# Altium schematic sheet ECR_Schem_1.SchDoc: ECR ESP32
size A3; Organization: INNEXIV Private Limited; Address2: Islamabad; Address3: Pakistan; DocumentNumber: 1.0; Revision: 1.0; SheetNumber: 1; SheetTotal: 1
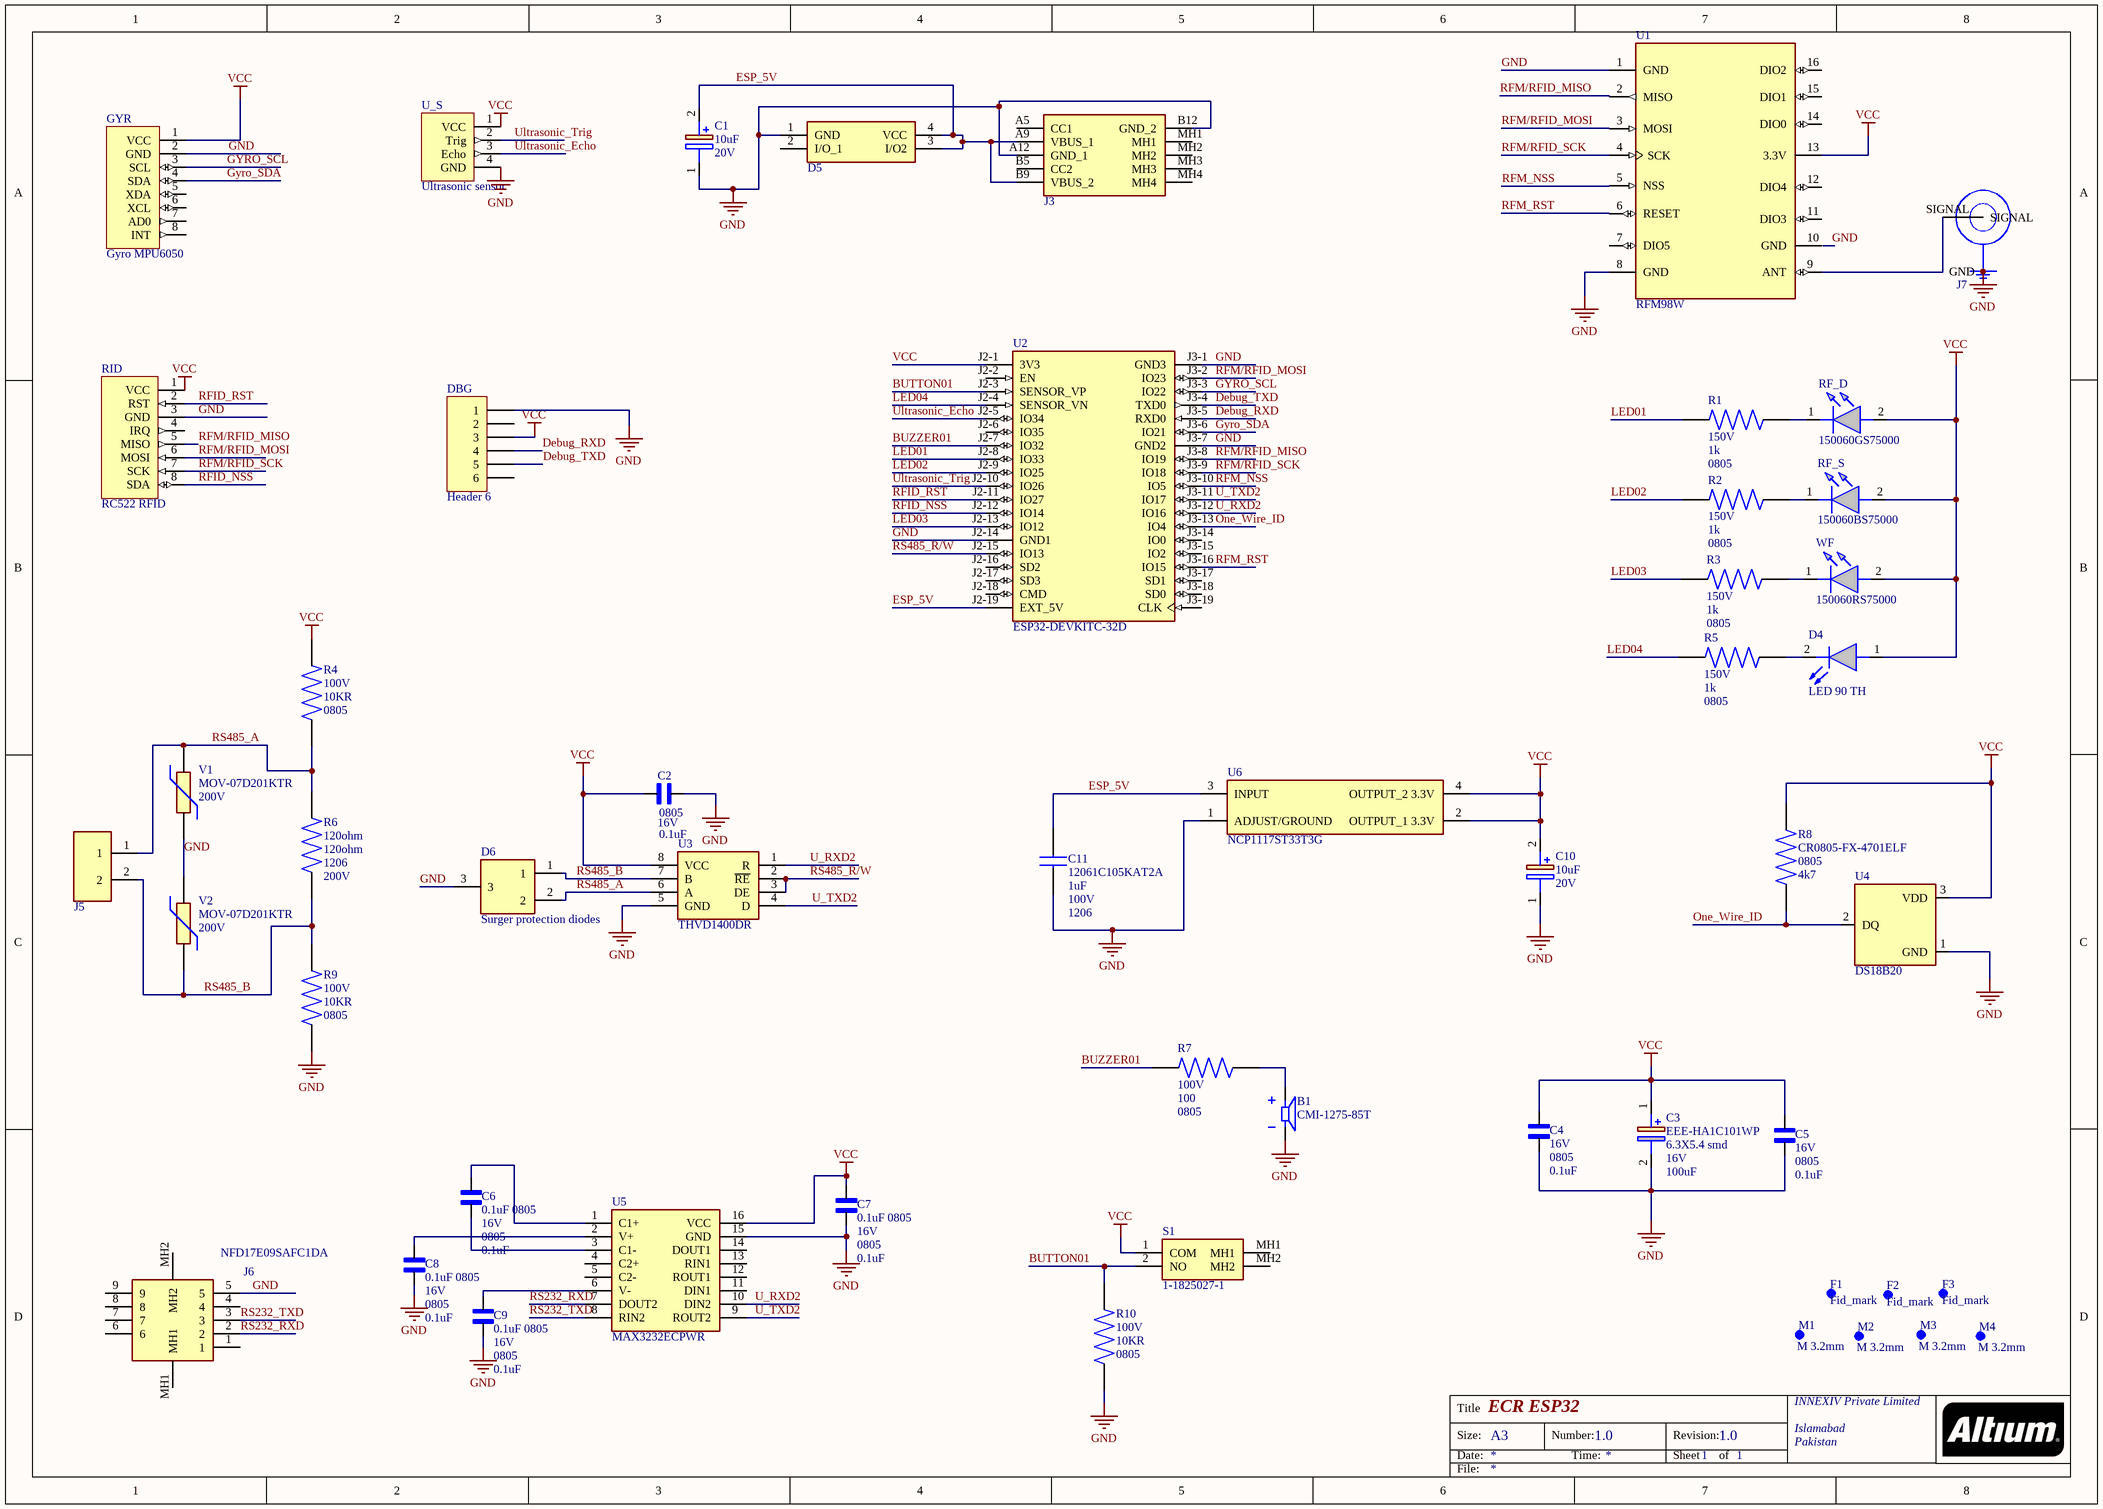
[diagram p0: ECR_Schem_1.SchDoc]

## Parts
B1  CMI-1275-85T  [CUI_CMI-1275-85T]
C1  value 10uF  Voltage: 20V  [CAPPM3528X210N]  (hidden comment: 10uF SMD Tantalum)
C2  value 0.1uF  Voltage: 16V  Package: 0805  [CAPC2012X90N]  (hidden comment: 0.1uF 0805)
C3  EEE-HA1C101WP  value 100uF  Package: 6.3X5.4 smd  Voltage: 16V  [CAPAE660X800N]
C4  value 0.1uF  Voltage: 16V  Package: 0805  [CAPC2012X90N]  (hidden comment: 0.1uF 0805)
C5  value 0.1uF  Voltage: 16V  Package: 0805  [CAPC2012X90N]  (hidden comment: 0.1uF 0805)
C6  0.1uF 0805  value 0.1uF  Voltage: 16V  Package: 0805  [CAPC2012X90N]
C7  0.1uF 0805  value 0.1uF  Voltage: 16V  Package: 0805  [CAPC2012X90N]
C8  0.1uF 0805  value 0.1uF  Voltage: 16V  Package: 0805  [CAPC2012X90N]
C9  0.1uF 0805  value 0.1uF  Voltage: 16V  Package: 0805  [CAPC2012X90N]
C10  value 10uF  Voltage: 20V  [CAPPM3528X210N]  (hidden comment: 10uF SMD Tantalum)
C11  12061C105KAT2A  value 1uF  Voltage: 100V  Package: 1206  [CAPC3216X229N]
D4  LED 90 TH  [HV-31210/260/SUB-U1930]
D5  5V fuse USB line  [SR0502CTG]  (value not drawn)
D6  Surger protection diodes  [SOT95P230X117-3N]
DBG  Header 6  [HDR1X6]
F1  Fid_mark  [FUP]  (no BOM)
F2  Fid_mark  [FUP]  (no BOM)
F3  Fid_mark  [FUP]  (no BOM)
GYR  Gyro MPU6050  [MPU_8pin]
J3  USB Type C PCB  [USB4125GFA]  (value not drawn)
J5  3.81mm wire to pcb  [1728284 3.81 wire to pcb]  (value not drawn)
J6  NFD17E09SAFC1DA  [NFD17E09SAFC1DA]
J7  IPEX antenna connector PCB  [AMPHENOL_A-1JB]  (value not drawn)
M1  M 3.2mm  [Screw Hole 3.2mm]  (no BOM)
M2  M 3.2mm  [Screw Hole 3.2mm]  (no BOM)
M3  M 3.2mm  [Screw Hole 3.2mm]  (no BOM)
M4  M 3.2mm  [Screw Hole 3.2mm]  (no BOM)
R1  value 1k  Voltage: 150V  Package: 0805  [0805_RESC2012X50N]  (hidden comment: 1kohm 0805)
R2  value 1k  Voltage: 150V  Package: 0805  [0805_RESC2012X50N]  (hidden comment: 1kohm 0805)
R3  value 1k  Voltage: 150V  Package: 0805  [0805_RESC2012X50N]  (hidden comment: 1kohm 0805)
R4  value 10KR  Voltage: 100V  Package: 0805  [0805_RESC2012X50N]  (hidden comment: 10K 0805)
R5  value 1k  Voltage: 150V  Package: 0805  [0805_RESC2012X50N]  (hidden comment: 1kohm 0805)
R6  120ohm  Package: 1206  Voltage: 200V  [1206_RESC3216X06N]
R7  value 100  Voltage: 100V  Package: 0805  [0805_RESC2012X50N]  (hidden comment: 100ohm 0805)
R8  CR0805-FX-4701ELF  value 4k7  Package: 0805  [0805_RESC2012X50N]
R9  value 10KR  Voltage: 100V  Package: 0805  [0805_RESC2012X50N]  (hidden comment: 10K 0805)
R10  value 10KR  Voltage: 100V  Package: 0805  [0805_RESC2012X50N]  (hidden comment: 10K 0805)
RF_D  150060GS75000  [LEDC1608X80N]
RF_S  150060BS75000  [LEDC1608X80N]
RID  RC522 RFID  [RFID_8pin]
S1  1-1825027-1  [118250271]
U1  RFM98W  [XCVR_RFM98W-433S2]
U2  ESP32-DEVKITC-32D  [MODULE_ESP32-DEVKITC-32D]
U3  THVD1400DR  [SOIC127P600X175-8N]
U4  DS18B20  [TO-92-TO92127P495H2044-3]
U5  MAX3232ECPWR  [SOP65P640X120-16N]
U6  NCP1117ST33T3G  [SOT230P700X180-4N]
U_S  Ultrasonic sensor  [UltraSonic 4 Pins]
V1  MOV-07D201KTR  Voltage: 200V  [MOV07D201KTR]
V2  MOV-07D201KTR  Voltage: 200V  [MOV07D201KTR]
WF  150060RS75000  [LEDC1608X80N]

## Nets
GND: B1.N C1.1 C2.2 C3.2(-) C4.1 C5.1 C7.1 C8.1 C9.1 C10.1 C11.1 D5.1(GND) D6.3 DBG.1 GYR.2(GND) J3.A12(GND_1) J3.B12(GND_2) J6.5 J7.GND1(GND) J7.GND2(GND) J7.OPTIONAL_GND(GND) R9.1 R10.1 RID.3(GND) U1.1(GND) U1.8(GND) U2.J2-14(GND1) U2.J3-1(GND3) U2.J3-7(GND2) U3.5(GND) U4.1(GND) U5.15(GND) U6.1(ADJUST/GROUND) U_S.4(GND) V1.1 V2.2
VCC: C2.1 C3.1(+) C4.2 C5.2 C7.2 C10.2 D4.1(A) DBG.3 GYR.1(VCC) R4.2 R8.2 RF_D.2(A) RF_S.2(A) RID.1(VCC) S1.1(COM) U1.13(3.3V) U2.J2-1(3V3) U3.8(VCC) U4.3(VDD) U5.16(VCC) U6.2(OUTPUT_1_3.3V) U6.4(OUTPUT_2_3.3V) U_S.1(VCC) WF.2(A)
BUTTON01: R10.2 S1.2(NO) U2.J2-3(SENSOR_VP)
BUZZER01: R7.1 U2.J2-7(IO32)
Debug_RXD: DBG.4 U2.J3-5(RXD0)
Debug_TXD: DBG.5 U2.J3-4(TXD0)
ESP_5V: C1.2 C11.2 D5.3(I/O2) D5.4(VCC) J3.A9(VBUS_1) J3.B9(VBUS_2) U2.J2-19(EXT_5V) U6.3(INPUT)
GYRO_SCL: GYR.3(SCL) U2.J3-3(IO22)
Gyro_SDA: GYR.4(SDA) U2.J3-6(IO21)
LED01: R1.1 U2.J2-8(IO33)
LED02: R2.1 U2.J2-9(IO25)
LED03: R3.1 U2.J2-13(IO12)
LED04: R5.1 U2.J2-4(SENSOR_VN)
One_Wire_ID: R8.1 U2.J3-13(IO4) U4.2(DQ)
RFID_NSS: RID.8(SDA) U2.J2-12(IO14)
RFID_RST: RID.2(RST) U2.J2-11(IO27)
RFM/RFID_MISO: RID.5(MISO) U1.2(MISO) U2.J3-8(IO19)
RFM/RFID_MOSI: RID.6(MOSI) U1.3(MOSI) U2.J3-2(IO23)
RFM/RFID_SCK: RID.7(SCK) U1.4(SCK) U2.J3-9(IO18)
RFM_NSS: U1.5(NSS) U2.J3-10(IO5)
RFM_RST: U1.6(RESET) U2.J3-16(IO15)
RS232_RXD: J6.2 U5.7(DOUT2)
RS232_TXD: J6.3 U5.8(RIN2)
RS485_A: D6.2 J5.1 R4.1 R6.2 U3.6(A) V1.2
RS485_B: D6.1 J5.2 R6.1 R9.2 U3.7(B) V2.1
RS485_R/W: U2.J2-15(IO13) U3.2(~{RE}) U3.3(DE)
U_RXD2: U2.J3-12(IO16) U3.1(R) U5.10(DIN2)
U_TXD2: U2.J3-11(IO17) U3.4(D) U5.9(ROUT2)
Ultrasonic_Echo: U2.J2-5(IO34) U_S.3(Echo)
Ultrasonic_Trig: U2.J2-10(IO26) U_S.2(Trig)
NetB1_P: B1.P R7.2
NetC6_1: C6.1 U5.3(C1-)
NetC6_2: C6.2 U5.1(C1+)
NetC8_2: C8.2 U5.2(V+)
NetC9_2: C9.2 U5.6(V-)
NetD4_2: D4.2(K) R5.2
NetJ7_SIGNAL: J7.SIGNAL U1.9(ANT)
NetR1_2: R1.2 RF_D.1(K)
NetR2_2: R2.2 RF_S.1(K)
NetR3_2: R3.2 WF.1(K)

Not connected (* = marked no-connect by the designer): D5 2(I/O_1); DBG 2 6; GYR 5(XDA) 6(XCL) 7(AD0) 8(INT); J3 A5(CC1) B5(CC2) MH1 MH2 MH3 MH4; J6 1 4 6 7 8 9 MH1 MH2; RID 4(IRQ); S1 MH1 MH2; U1 7(DIO5) 10(GND) 11(DIO3) 12(DIO4) 14(DIO0) 15(DIO1) 16(DIO2); U2 J2-2(EN) J2-6(IO35) J2-16(SD2) J2-17(SD3) J2-18(CMD) J3-14(IO0) J3-15(IO2) J3-17(SD1) J3-18(SD0) J3-19(CLK); U5 4(C2+) 5(C2-) 11(DIN1) 12(ROUT1) 13(RIN1) 14(DOUT1)

## Notes on the sheet
- Title
- Size:
- Date:
- A3
- Number:
- Time:
- Revision:
- Sheet
- of
- File:

## Library data of the parts
B1 = CMI-1275-85T: 5V CUI Inc Buzzer; Price: None; Availability: Unavailable; MP: CMI-1275-85T; Package: None; Value: *
C1 C10 = TPSB106K020R1000: TPS SMT tant capacitor,Case B,20V,10uF AVX 10uF SMD Solid MnO2 Tantalum Electrolytic Capacitor, 20 V dc /-10%, TPS Series; Manufacturer_Name: Kyocera AVX; Datasheet Link: http://datasheets.avx.com/TPS.pdf; Height: 2.1mm; Manufacturer_Part_Number: TPSB106K020R1000; Mouser Part Number: 581-TPSB106K020R1000; Mouser Price/Stock: https://www.mouser.co.uk/ProductDetail/AVX/TPSB106K020R1000?qs=SRux0XfyV6nBXE%252BNULTPuA%3D%3D; Arrow Part Number: TPSB106K020R1000; Arrow Price/Stock: https://www.arrow.com/en/products/tpsb106k020r1000/avx
C2 C4-C9 = VJ0805Y104JXJPW1BC: Cap Ceramic 0.1uF 16V X7R 5% SMD 0805 125Â°C Paper T/R; MF: Vishay Vitramon; SnapEDA_Link: https://www.snapeda.com/parts/VJ0805Y104JXJPW1BC/Vishay+Vitramon/view-part/?ref=snap; MP: VJ0805Y104JXJPW1BC; Check_prices: https://www.snapeda.com/parts/VJ0805Y104JXJPW1BC/Vishay+Vitramon/view-part/?ref=eda
C3 = EEE-HA1C101WP: Cap Aluminum Lytic 100uF 16V 20% (6.3 X 5.4mm) SMD 70mA 1000h 105C Automotive T/R
C11 = 12061C105KAT2A: Capacitor MLCC 1206 1uF 100V AVX 1206 FlEXITERM 1??F Ceramic Multilayer Capacitor, 100 V dc X7R Dielectric ??10% SMD; Geometry.Height: 2.29mm; Manufacturer_Name: AVX; Manufacturer_Part_Number: 12061C105KAT2A; Mouser Part Number: 581-12061C105KAT2A; Mouser Price/Stock: https://www.mouser.co.uk/ProductDetail/AVX/12061C105KAT2A?qs=sEn5VCT5PiZZ0oBgoI7byA%3D%3D; Arrow Part Number: 12061C105KAT2A; Arrow Price/Stock: https://www.arrow.com/en/products/12061c105kat2a/avx; Datasheet Link: http://datasheets.avx.com/X7RDielectric.pdf
D4 = HV-31210/260/SUB-U1930: HARVATEK 3.0MM ROUND LED LAMP WI; Color: Blue; Package: TH 90degree
D5 = SR05-02CTG: LITTELFUSE - SR05-02CTG - DIODE, ESD PROTECTION, 5V, SOT-143; Datasheet Link: https://www.arrow.com/en/products/sr05-02ctg/littelfuse; Height: 1mm; Manufacturer_Name: LITTELFUSE; Manufacturer_Part_Number: SR05-02CTG; Mouser Part Number: 576-SR05-02CTG; Mouser Price/Stock: https://www.mouser.co.uk/ProductDetail/Littelfuse/SR05-02CTG?qs=txCqAXsCGkfW1ErBg03wlg%3D%3D; Arrow Part Number: SR05-02CTG; Arrow Price/Stock: https://www.arrow.com/en/products/sr05-02ctg/littelfuse?region=nac
D6 = CDSOT23-SM712: Diode; Manufacturer_Name: Bourns; Datasheet Link: http://uk.rs-online.com/web/p/products/7673728; Height: 1.17mm; Manufacturer_Part_Number: CDSOT23-SM712; Mouser Part Number: 652-CDSOT23-SM712; Mouser Price/Stock: https://www.mouser.co.uk/ProductDetail/Bourns/CDSOT23-SM712?qs=FuI%252BOVLl4%2FLTY%2FGQ265RLA%3D%3D; Arrow Part Number: CDSOT23-SM712; Arrow Price/Stock: https://www.arrow.com/en/products/cdsot23-sm712/bourns?region=europe
DBG = Header 6: Header, 6-Pin; LatestRevisionDate: 17-Jul-2002; LatestRevisionNote: Re-released for DXP Platform.; Publisher: Altium Limited
F1-F3 = Fid_mark: Fiducial_mark
GYR = MPU_6050: MPU_6050 / Gyroscope
J3 = USB4125-GF-A: USB-C (USB TYPE-C) Receptacle Connector 24 (6+18 Dummy) Position Surface Mount, Right Angle; Through Hole; Manufacturer_Name: GCT (GLOBAL CONNECTOR TECHNOLOGY); Datasheet Link: https://gct.co/files/drawings/usb4125.pdf?v=f2858e04-a173-4b74-b17f-8f865ddc3728; Height: 3.41mm; Manufacturer_Part_Number: USB4125-GF-A; Mouser Part Number: 640-USB4125-GF-A; Mouser Price/Stock: https://www.mouser.co.uk/ProductDetail/GCT/USB4125-GF-A?qs=KUoIvG%2F9IlaIQ4zBJ6gLeA%3D%3D
J5 = 1728284 terminal block 3.81: TERM BLOCK 2POS 55DEG 3.81MM PCB; Manufacturer: Phoenix contact; Price: 1
J6 = NFD17E09SAFC1DA: D-Sub, 9 Pin Socket, Right Angle, Boardlocks #4-40 UNC Threaded Hole; Manufacturer_Name: Amphenol Communications Solutions; Geometry.Height: 12.93mm; Manufacturer_Part_Number: NFD17E09SAFC1DA; Mouser Part Number: *; Mouser Price/Stock: *; Arrow Part Number: *; Arrow Price/Stock: *; Datasheet Link: https://cdn.amphenol-cs.com/media/wysiwyg/files/drawing/p-nfd17-xxxsa-fc1d-a.pdf
J7 = A-1JB: AMC IPEX Straight PCB Jack, Surface Mount, 2500 pc Reel, 50 Ohm; Package: None; MP: A-1JB; Price: None; Availability: Unavailable; Value: *
M1-M4 = Munting Hole 3.2mm: PCB Munting Hole 3.2mm; Package: Mounting Screw
R1-R3 R5 = AC0805JR-071KL: Thick Film Resistors - SMD 1 k Ohms 125mW 0805 5% AEC-Q200 Standard Power Version; MF: {'manufacturer': u'Bourns'}; Availability: Unavailable; MP: AC0805JR-071KL; Tolerance: 5%
R4 R9 R10 = CR0805-FX-1002ELF: RESISITOR, 0805, 10KR, 1%; Power Rating:125mW; Resistance:10kohm; Resistance Tolerance:Â± 1%; Series:CR; Operating Temperature Range:-55Â°C to +155Â°C; Resistor Element Type:Thick Film; Voltage, Rating:100V; Temperature Coefficient:Â± 100ppm; Case Style:0805; MF: {'manufacturer': u'Bourns'}; MP: CR0805-FX-1002ELF; Availability: Unavailable
R6 = WR12X1002FTL: RES 120 OHM 5% 1/4W 1206; Part Number: WR12X1002FTL; Value: 120ohm
R7 = ERJ-P06J101V: Thick Film Resistors - SMD 0805 100ohms 0.5W 5% Tolerance; MF: {'manufacturer': u'Bourns'}; Availability: Unavailable; MP: ERJ-P06J101V; Tolerance: 5%
R8 = CR0805-FX-4701ELF: BOURNS - CR0805-FX-4701ELF - RES, THICK FILM, 4K7, 1%, 0.125W, 0805; Geometry.Height: 0.6mm; Manufacturer_Name: Bourns; Manufacturer_Part_Number: CR0805-FX-4701ELF; Mouser Part Number: 652-CR0805FX-4701ELF; Mouser Price/Stock: https://www.mouser.co.uk/ProductDetail/Bourns/CR0805-FX-4701ELF?qs=TYKCbaKwe1AuFEtkTBQjKg%3D%3D; Arrow Part Number: CR0805-FX-4701ELF; Arrow Price/Stock: https://www.arrow.com/en/products/cr0805-fx-4701elf/bourns?region=europe; Datasheet Link: https://www.bourns.com/pdfs/chpreztr.pdf
RF_D = 150060GS75000: Wurth Elektronik WL-SMCW 520 nm Green LED, 1608 (0603) Clear SMD package; Geometry.Height: 0.8mm; Manufacturer_Name: Wurth Elektronik; Manufacturer_Part_Number: 150060GS75000; Mouser Part Number: 710-150060GS75000; Mouser Price/Stock: https://www.mouser.co.uk/ProductDetail/Wurth-Elektronik/150060GS75000?qs=LlUlMxKIyB0UYkq5lDO8nA%3D%3D; Arrow Part Number: *; Arrow Price/Stock: *; Datasheet Link: https://componentsearchengine.com/Datasheets/2/150060GS75000.pdf
RF_S = 150060BS75000: LED,Wurth Elektronik,150060BS75000 Wurth Elektronik 150060BS75000, WL-SMCW Series Blue LED, 470 nm 1608 (0603) Clear, Rectangle Lens SMD package; Geometry.Height: 0.8mm; Manufacturer_Name: Wurth Elektronik; Manufacturer_Part_Number: 150060BS75000; Mouser Part Number: 710-150060BS75000; Mouser Price/Stock: https://www.mouser.co.uk/ProductDetail/Wurth-Elektronik/150060BS75000?qs=LlUlMxKIyB2DLLpXQThavA%3D%3D; Arrow Part Number: *; Arrow Price/Stock: *; Datasheet Link: https://componentsearchengine.com/Datasheets/2/150060BS75000.pdf
RID = RFID-RC522: RFID card reader
S1 = 1-1825027-1: Black Button Tactile Switch, Single Pole Single Throw (SPST) 50 mA @ 24 V dc 5.74mm; Manufacturer_Name: TE Connectivity; Geometry.Height: 7.01mm; Manufacturer_Part_Number: 1-1825027-1; Mouser Part Number: *; Mouser Price/Stock: *; Arrow Part Number: 1-1825027-1; Arrow Price/Stock: https://www.arrow.com/en/products/1-1825027-1/te-connectivity?region=europe; Datasheet Link: https://www.te.com/commerce/DocumentDelivery/DDEController?Action=srchrtrv&DocNm=1308111-1_SWITCHES_CORE_PROGRAM_CATALOG&DocType=CS&DocLang=English
U1 = RFM98W: 802.15.4, General ISM < 1GHz LoRaâ„¢ Transceiver Module 433MHz Surface Mount; MF: RF Solutions; MP: RFM98W-433S2; Value: *; SnapEDA_Link: https://www.snapeda.com/parts/RFM98W-433S2/RF%20Solutions/view-part/583263/?ref=snap; Package: SMD-16 RF Solutions; Availability: Unavailable; Price: None
U2 = ESP32-DEVKITC-32D: WiFi Development Tools (802.11) ESP32 General Development Kit, ESP32-WROOM-32D on the board; MF: Espressif Systems; SnapEDA_Link: https://www.snapeda.com/parts/ESP32-DEVKITC-32D/Espressif+Systems/view-part/?ref=snap; Package: None; Value: *; MP: ESP32-DEVKITC-32D; Check_prices: https://www.snapeda.com/parts/ESP32-DEVKITC-32D/Espressif+Systems/view-part/?ref=eda
U3 = THVD1400DR: RS-422/RS-485 Interface IC 3.3-V to 5-V RS-485 transceiver in small package with +/-8-kV IEC ESD protection 8-SOIC -40 to 125; Manufacturer_Name: Texas Instruments; Geometry.Height: 1.75mm; Manufacturer_Part_Number: THVD1400DR; Mouser Part Number: 595-THVD1400DR; Mouser Price/Stock: https://www.mouser.co.uk/ProductDetail/Texas-Instruments/THVD1400DR?qs=eP2BKZSCXI7bzZdDjIHgHQ%3D%3D; Arrow Part Number: THVD1400DR; Arrow Price/Stock: https://www.arrow.com/en/products/thvd1400dr/texas-instruments?region=nac; Datasheet Link: https://www.arrow.com/en/products/thvd1400dr/texas-instruments
U4 = DS18B20: Temperature Sensor Digital, Local -55Â°C ~ 125Â°C 12 b 8-uMAX-EP¦8-uSOP-EP; MF: Maxim; Value: *; SnapEDA_Link: https://www.snapeda.com/parts/DS18B20/Maxim+Integrated/view-part/?ref=snap; Purchase-URL: https://pricing.snapeda.com/search/part/DS18B20/?ref=eda; Availability: In Stock; Price: None; Package: TO-226-3 Maxim; Check_prices: https://www.snapeda.com/parts/DS18B20/Maxim+Integrated/view-part/?ref=eda; MP: DS18B20
U5 = MAX3232ECPWR: 3-V to 5.5-V multichannel RS-232 line driver and receiver with +/-15-kV IEC ESD protection; Manufacturer_Name: Texas Instruments; Geometry.Height: 1.2mm; Manufacturer_Part_Number: MAX3232ECPWR; Mouser Part Number: 595-MAX3232ECPWR; Mouser Price/Stock: https://www.mouser.co.uk/ProductDetail/Texas-Instruments/MAX3232ECPWR?qs=paYhMW8qfis8NsHohmO7ng%3D%3D; Arrow Part Number: MAX3232ECPWR; Arrow Price/Stock: https://www.arrow.com/en/products/max3232ecpwr/texas-instruments?region=nac; Datasheet Link: http://www.ti.com/general/docs/lit/getliterature.tsp?genericPartNumber=MAX3232E&fileType=pdf&HQS=ti-null-null-sf-df-pf-sep-wwe&DCM=yes
U6 = NCP1117ST33T3G: ON SEMICONDUCTOR - NCP1117ST33T3G - IC, LINEAR VOLTAGE REGULATOR; Manufacturer_Name: onsemi; Geometry.Height: 1.8mm; Manufacturer_Part_Number: NCP1117ST33T3G; Mouser Part Number: 863-NCP1117ST33T3G; Mouser Price/Stock: https://www.mouser.co.uk/ProductDetail/onsemi/NCP1117ST33T3G?qs=Gev%252BmEvV0iZb%2FE8ahUDx3w%3D%3D; Arrow Part Number: NCP1117ST33T3G; Arrow Price/Stock: https://www.arrow.com/en/products/ncp1117st33t3g/on-semiconductor?region=europe; Datasheet Link: http://www.onsemi.com/pub/Collateral/NCP1117-D.PDF
U_S = HC-SR04: Hc Sr04 Arduino Ultrasonic Sensor
V1 V2 = MOV-07D201KTR: VARISTOR 200V 1.2KA DISC 7MM; Manufacturer_Name: Bourns; Geometry.Height: 11mm; Manufacturer_Part_Number: MOV-07D201KTR; Mouser Part Number: 652-MOV-07D201KTR; Mouser Price/Stock: https://www.mouser.co.uk/ProductDetail/Bourns/MOV-07D201KTR?qs=lgttKnAd%252B2CY9Zo2Or70XQ%3D%3D; Arrow Part Number: MOV-07D201KTR; Arrow Price/Stock: https://www.arrow.com/en/products/mov-07d201ktr/bourns?region=nac; Datasheet Link: https://www.bourns.com/docs/Product-Datasheets/MOV07D.pdf; Disk: 7mm
WF = 150060RS75000: WURTH ELEKTRONIK - 150060RS75000 - LED, 0603, RED, 250MCD, 625NM; Geometry.Height: 0.8mm; Manufacturer_Name: Wurth Elektronik; Manufacturer_Part_Number: 150060RS75000; Mouser Part Number: 710-150060RS75000; Mouser Price/Stock: https://www.mouser.co.uk/ProductDetail/Wurth-Elektronik/150060RS75000?qs=LlUlMxKIyB3QnmZ3fw%2FVCA%3D%3D; Arrow Part Number: *; Arrow Price/Stock: *; Datasheet Link: http://katalog.we-online.de/led/datasheet/150060RS75000.pdf